# Altium schematic sheet teplomer.SCHDOC
size A4; PageSetup: Record=PageOptions|CenterHorizontal=True|CenterVertical=True|PrintScale=0.91|XCorrection=1.00|YCorrection=1.00|PrintKind=1|BorderSize=5000000|LeftOffset=0|BottomOffset=0|Orientation=2|PaperLength=1000|PaperWidth=1000|Scale=100|PaperSource=15|PrintQuality=600|MediaType=1|DitherType=10|PaperKind=Letter|PrintScaleMode=1
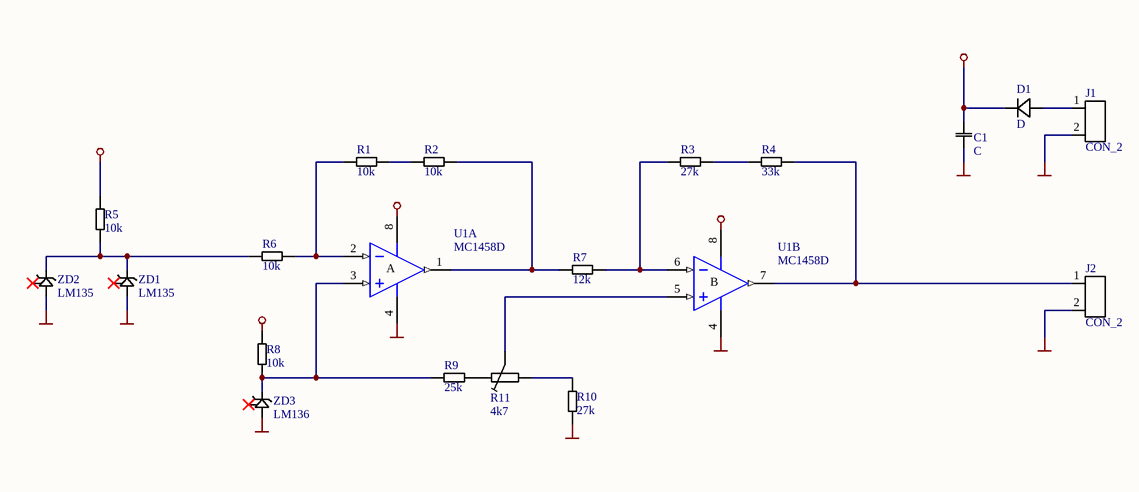
[diagram p0: teplomer.SCHDOC]

## Parts
C1  C  [C0805]
D1  D  [SMA]
J1  CON_2  [ARK_2]
J2  CON_2  [ARK_2]
R1  10k  [R0805]
R2  10k  [R0805]
R3  27k  [R0805]
R4  33k  [R0805]
R5  10k  [R0805]
R6  10k  [R0805]
R7  12k  [R0805]
R8  10k  [R0805]
R9  25k  [R0805]
R10  27k  [R0805]
R11  4k7  [Trimr PT655]
U1  MC1458D  [SO8]  (parts A,B of 2)
ZD1  LM135  [SO8]
ZD2  LM135  [TO-92]
ZD3  LM136  [SO8]

## Nets
GND: C1.1 J1.2 J2.2 R10.2 U1.4(V-) ZD1.3(A) ZD2.3(A) ZD3.3(A)
Vs: C1.2 D1.2(K) R5.1 R8.1 U1.8(V+)
NetD1_1: D1.1(A) J1.1
NetJ2_1: J2.1 R4.1 U1.7(OUT)
NetR1_1: R1.1 R2.2
NetR1_2: R1.2 R6.1 U1.2(IN-)
NetR2_1: R2.1 R7.2 U1.1(OUT)
NetR3_1: R3.1 R4.2
NetR3_2: R3.2 R7.1 U1.6(IN-)
NetR5_2: R5.2 R6.2 ZD1.2(K) ZD2.2(K)
NetR8_2: R8.2 R9.1 U1.3(IN+) ZD3.2(K)
NetR9_2: R9.2 R11.2
NetR10_1: R10.1 R11.1
NetR11_3: R11.3 U1.5(IN+)

Not connected (* = marked no-connect by the designer): ZD1 1(ADJ)*; ZD2 1(ADJ)*; ZD3 1(ADJ)*

## Notes on the sheet
- Title
- STMicroelectronics assumes no responsibility for the consequences of the use of this information
- Size:
- Date:
- Doc. Reference:
- A4
- Author:
- Time:
- Revision:
- Sheet
- of
- File:
- Created by:
- (in symbol MC1458D, part A) A
- (in symbol MC1458D, part B) B

## Library data of the parts
R1-R10 = R
R11 = Trimr
U1 = MC1458D: Dual Operational Amplifier; Published: 24-Aug-2001; LatestRevisionDate: 6-Jun-2005; LatestRevisionNote: Stylized 3D Model Added.; DatasheetDocument: Oct-1997; PackageDocument: Jul-1998; PackageReference: SO8; Publisher: Altium Limited; Code_JEDEC: MS-012-AA; Code_IPC: SO8; ComponentLink1Description: Manufacturer Link; ComponentLink1URL: http://www.st.com/
ZD1 ZD3 = LM135: pin to pad: 1>5 2>8 3>4